# Altium schematic sheet Measure.SchDoc
size A4
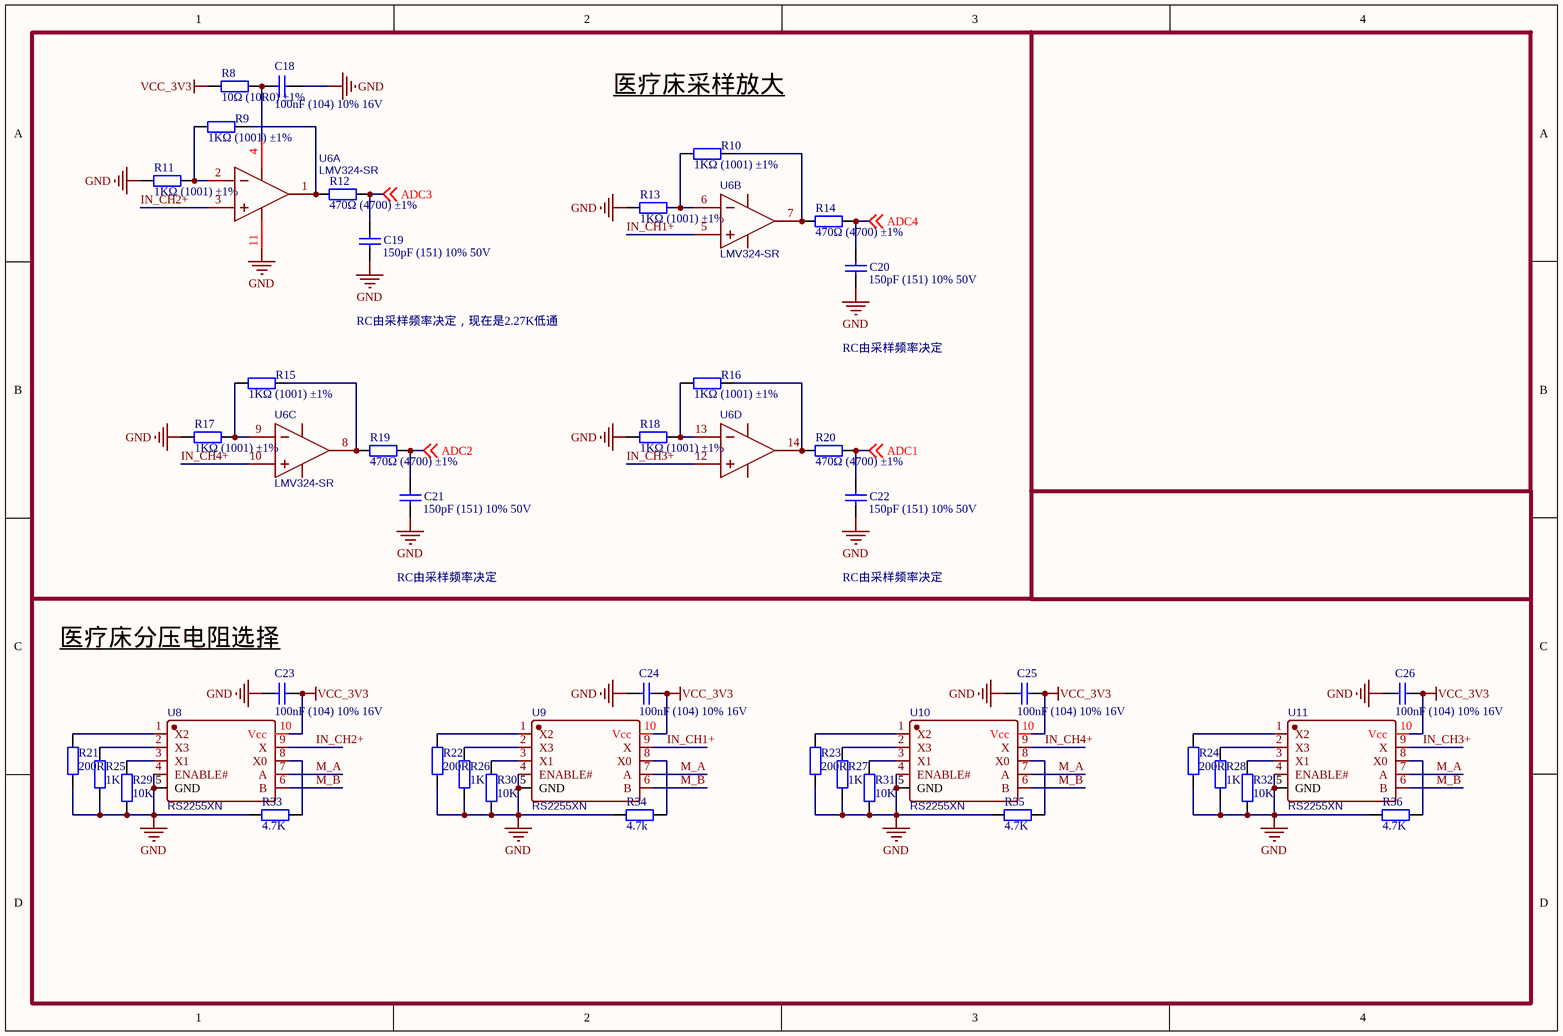
[diagram p0: Measure.SchDoc]

## Parts
C18  100nF (104) 10% 16V  [0402_C]
C19  150pF (151) 10% 50V  [0402_C]
C20  150pF (151) 10% 50V  [0402_C]
C21  150pF (151) 10% 50V  [0402_C]
C22  150pF (151) 10% 50V  [0402_C]
C23  100nF (104) 10% 16V  [0402_C]
C24  100nF (104) 10% 16V  [0402_C]
C25  100nF (104) 10% 16V  [0402_C]
C26  100nF (104) 10% 16V  [0402_C]
R8  10Ω (10R0) ±1%  [0402_R]
R9  1KΩ (1001) ±1%  [0402_R]
R10  1KΩ (1001) ±1%  [0402_R]
R11  1KΩ (1001) ±1%  [0402_R]
R12  470Ω (4700) ±1%  [0402_R]
R13  1KΩ (1001) ±1%  [0402_R]
R14  470Ω (4700) ±1%  [0402_R]
R15  1KΩ (1001) ±1%  [0402_R]
R16  1KΩ (1001) ±1%  [0402_R]
R17  1KΩ (1001) ±1%  [0402_R]
R18  1KΩ (1001) ±1%  [0402_R]
R19  470Ω (4700) ±1%  [0402_R]
R20  470Ω (4700) ±1%  [0402_R]
R21  200R  [0402_R]
R22  200R  [0402_R]
R23  200R  [0402_R]
R24  200R  [0402_R]
R25  1K  [0402_R]
R26  1K  [0402_R]
R27  1K  [0402_R]
R28  1K  [0402_R]
R29  10K  [0402_R]
R30  10K  [0402_R]
R31  10K  [0402_R]
R32  10K  [0402_R]
R33  4.7K  [0402_R]
R34  4.7k  [0402_R]
R35  4.7K  [0402_R]
R36  4.7K  [0402_R]
U6  LMV324-SR  [SOP-14_L8.6-W3.9-P1.27-LS6.0-BL]  (parts A,B,C,D of 4)
U8  RS2255XN  [MSOP-10_L3.0-W3.0-P0.50-LS5.0-BL]
U9  RS2255XN  [MSOP-10_L3.0-W3.0-P0.50-LS5.0-BL]
U10  RS2255XN  [MSOP-10_L3.0-W3.0-P0.50-LS5.0-BL]
U11  RS2255XN  [MSOP-10_L3.0-W3.0-P0.50-LS5.0-BL]

## Nets
GND: C18.2 C19.1 C20.1 C21.1 C22.1 C23.2 C24.2 C25.2 C26.2 R11.1 R13.1 R17.1 R18.1 R21.1 R22.1 R23.1 R24.1 R25.2 R26.2 R27.2 R28.2 R29.2 R30.2 R31.2 R32.2 R33.2 R34.2 R35.2 R36.2 U6.11(GND) U8.4(ENABLE#) U8.5(GND) U9.4(ENABLE#) U9.5(GND) U10.4(ENABLE#) U10.5(GND) U11.4(ENABLE#) U11.5(GND)
VCC_3V3: C23.1 C24.1 C25.1 C26.1 R8.1 U8.10(Vcc) U9.10(Vcc) U10.10(Vcc) U11.10(Vcc)
ADC1: C22.2 R20.2 ; off-sheet ADC1
ADC2: C21.2 R19.2 ; off-sheet ADC2
ADC3: C19.2 R12.2 ; off-sheet ADC3
ADC4: C20.2 R14.2 ; off-sheet ADC4
IN_CH1+: U6.5(2IN+) U9.9(X)
IN_CH2+: U6.3(1IN+) U8.9(X)
IN_CH3+: U6.12(4IN+) U11.9(X)
IN_CH4+: U6.10(3IN+) U10.9(X)
M_A: U8.7(A) U9.7(A) U10.7(A) U11.7(A)
M_B: U8.6(B) U9.6(B) U10.6(B) U11.6(B)
NetC18_1: C18.1 R8.2 U6.4(VCC)
NetR9_1: R9.1 R11.2 U6.2(1IN-)
NetR9_2: R9.2 R12.1 U6.1(1OUT)
NetR10_1: R10.1 R13.2 U6.6(2IN-)
NetR10_2: R10.2 R14.1 U6.7(2OUT)
NetR15_1: R15.1 R17.2 U6.9(3IN-)
NetR15_2: R15.2 R19.1 U6.8(3OUT)
NetR16_1: R16.1 R18.2 U6.13(4IN-)
NetR16_2: R16.2 R20.1 U6.14(4OUT)
NetR21_2: R21.2 U8.1(X2)
NetR22_2: R22.2 U9.1(X2)
NetR23_2: R23.2 U10.1(X2)
NetR24_2: R24.2 U11.1(X2)
NetR25_1: R25.1 U8.2(X3)
NetR26_1: R26.1 U9.2(X3)
NetR27_1: R27.1 U10.2(X3)
NetR28_1: R28.1 U11.2(X3)
NetR29_1: R29.1 U8.3(X1)
NetR30_1: R30.1 U9.3(X1)
NetR31_1: R31.1 U10.3(X1)
NetR32_1: R32.1 U11.3(X1)
NetR33_1: R33.1 U8.8(X0)
NetR34_1: R34.1 U9.8(X0)
NetR35_1: R35.1 U10.8(X0)
NetR36_1: R36.1 U11.8(X0)

## Notes on the sheet
- 医疗床采样放大
- RC由采样频率决定，现在是2.27K低通
- RC由采样频率决定
- 医疗床分压电阻选择

## Library data of the parts
C18 C23-C26 = 0402 100nF (104) 10% 16V: 贴片电容; ComponentLink1Description: 供应商链接; ComponentLink1URL: http://www.szlcsc.com/product/details_1877.html; Package: 0402; Supplier: LC; SuppliersPartNumber: C1525
C19-C22 = 0402 150pF (151) 10% 50V: 贴片电容; ComponentLink1Description: 供应商链接; ComponentLink1URL: http://www.szlcsc.com/product/details_1879.html; Package: 0402; Supplier: LC; SuppliersPartNumber: C1527
R8 = 0402 10Ω (10R0) 1%: 贴片电阻; ComponentLink1Description: 供应商链接; ComponentLink1URL: http://www.szlcsc.com/product/details_25820.html; Package: 0402; Supplier: LC; SuppliersPartNumber: C25077
R9-R11 R13 R15-R18 R25-R28 = 0402 1KΩ (1001) 1%: 贴片电阻; ComponentLink1Description: 供应商链接; ComponentLink1URL: http://www.szlcsc.com/product/details_12256.html; Package: 0402; Supplier: LC; SuppliersPartNumber: C11702
R12 R14 R19 R20 = 0402 470Ω (4700) 1%: 贴片电阻; ComponentLink1Description: 供应商链接; ComponentLink1URL: http://www.szlcsc.com/product/details_25860.html; Package: 0402; Supplier: LC; SuppliersPartNumber: C25117
R21-R24 = 0402 200Ω (2000) 1%: 贴片电阻; ComponentLink1Description: 供应商链接; ComponentLink1URL: http://www.szlcsc.com/product/details_25830.html; Package: 0402; Supplier: LC; SuppliersPartNumber: C25087
R29-R32 = 0402 10KΩ (1002) 1%: 贴片电阻; ComponentLink1Description: 供应商链接; ComponentLink1URL: http://www.szlcsc.com/product/details_26487.html; Package: 0402; Supplier: LC; SuppliersPartNumber: C25744
R33-R36 = 0402 4.7KΩ (4701) 1%: 贴片电阻; ComponentLink1Description: 供应商链接; ComponentLink1URL: http://www.szlcsc.com/product/details_26643.html; Package: 0402; Supplier: LC; SuppliersPartNumber: C25900
U6 = LMV324-SR: BOM_Manufacturer: IDCHIP; BOM_Manufacturer Part: LMV324; subpart_no: 3; BOM_Supplier: LCSC; BOM_Supplier Part: C395458; BOM_JLCPCB Part Class: Extended Part; spicePre: U; spiceSymbolName: LMV324
U8-U11 = RS2255XN: BOM_Manufacturer: Jiangsu RUNIC Tech; Contributor: LCSC; BOM_Supplier: LCSC; BOM_Supplier Part: C783421; BOM_Manufacturer Part: RS2255XN; BOM_JLCPCB Part Class: Extended Part; spicePre: U; spiceSymbolName: RS2255XN